# Altium project Switch.PrjPcb
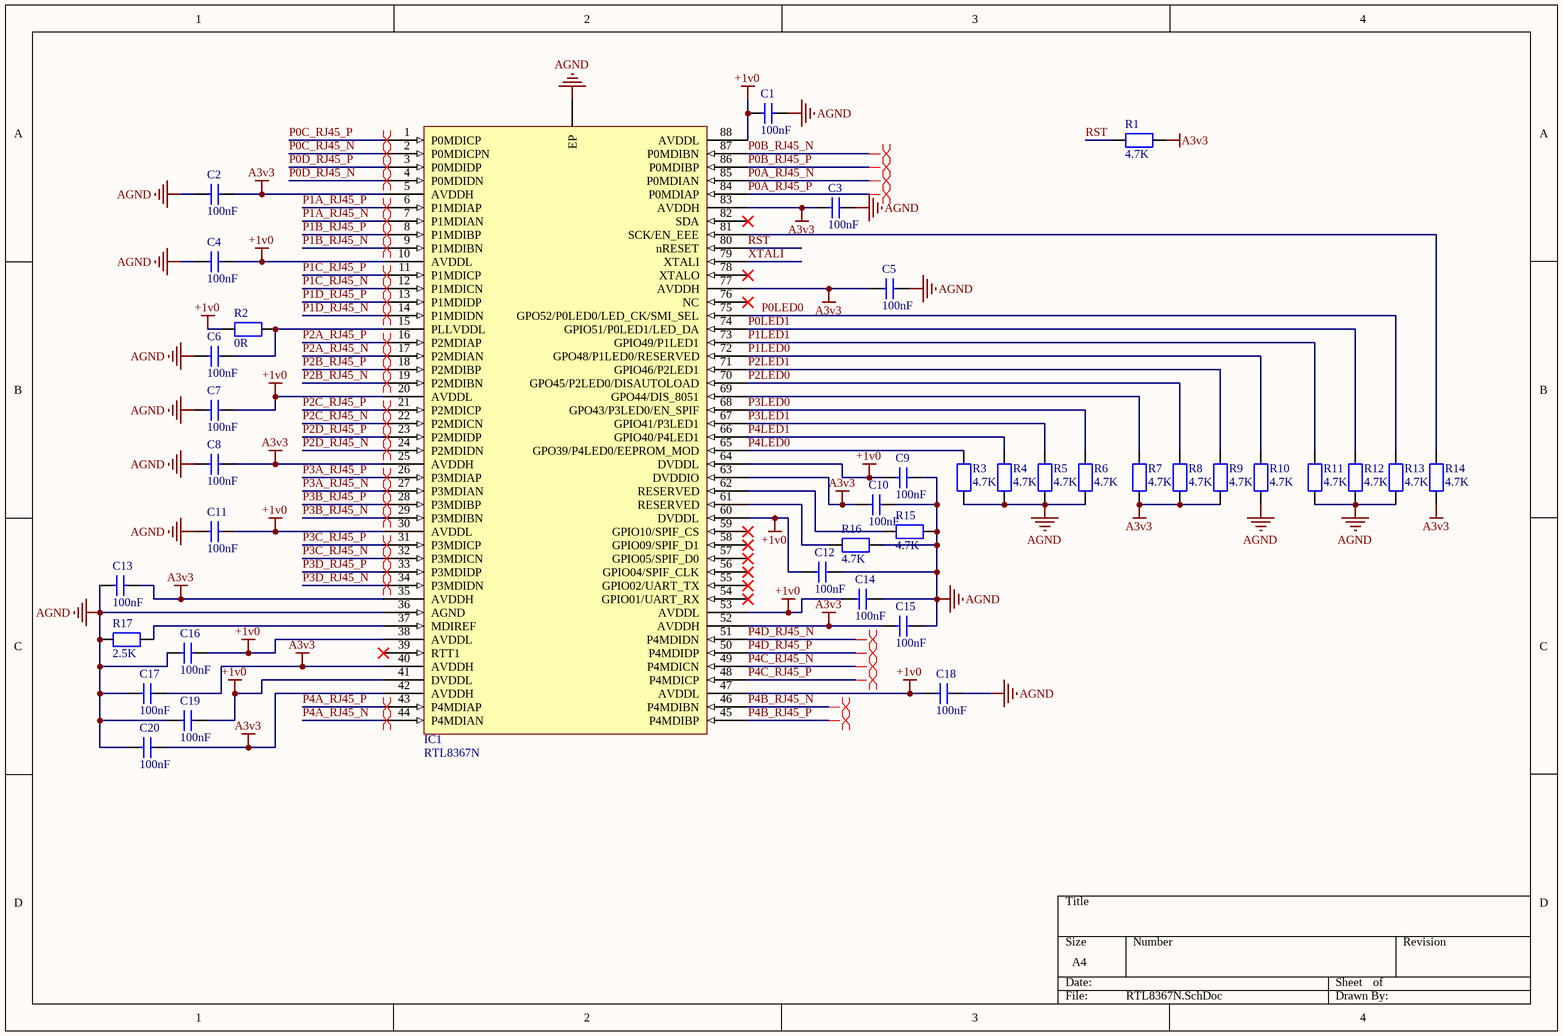
[diagram p0: RTL8367N.SchDoc]
4 sheets, 94 parts. Net scope: global (net labels, ports and power ports of the same name join across sheets).
Board file: Switch.PcbDoc
Sheets:
  RTL8367N.SchDoc
  RJ45.SchDoc
  Power.SchDoc
  Crystal.SchDoc

## Sheet RTL8367N.SchDoc
size A4; SheetNumber: 1; SheetTotal: 4

### Parts
C1  100nF  [C-0603]
C2  100nF  [C-0603]
C3  100nF  [C-0603]
C4  100nF  [C-0603]
C5  100nF  [C-0603]
C6  100nF  [C-0603]
C7  100nF  [C-0603]
C8  100nF  [C-0603]
C9  100nF  [C-0603]
C10  100nF  [C-0603]
C11  100nF  [C-0603]
C12  100nF  [C-0603]
C13  100nF  [C-0603]
C14  100nF  [C-0603]
C15  100nF  [C-0603]
C16  100nF  [C-0603]
C17  100nF  [C-0603]
C18  100nF  [C-0603]
C19  100nF  [C-0603]
C20  100nF  [C-0603]
IC1  RTL8367N  [QFN40P1000X1000X90_HS-89M]
R1  4.7K  [RESMELF3515L]
R2  0R  [RESMELF3515L]
R3  4.7K  [RESMELF3515L]
R4  4.7K  [RESMELF3515L]
R5  4.7K  [RESMELF3515L]
R6  4.7K  [RESMELF3515L]
R7  4.7K  [RESMELF3515L]
R8  4.7K  [RESMELF3515L]
R9  4.7K  [RESMELF3515L]
R10  4.7K  [RESMELF3515L]
R11  4.7K  [RESMELF3515L]
R12  4.7K  [RESMELF3515L]
R13  4.7K  [RESMELF3515L]
R14  4.7K  [RESMELF3515L]
R15  4.7K  [RESMELF3515L]
R16  4.7K  [RESMELF3515L]
R17  2.5K  [RESMELF3515L]

### Nets
+1v0: C1.1 C4.2 C7.2 C9.1 C11.2 C12.1 C14.1 C16.2 C18.1 C19.2 IC1.10(AVDDL) IC1.20(AVDDL) IC1.30(AVDDL) IC1.38(AVDDL) IC1.41(DVDDL) IC1.47(AVDDL) IC1.53(AVDDL) IC1.60(DVDDL) IC1.64(DVDDL) IC1.88(AVDDL) R2.1
A3v3: C2.2 C3.1 C5.1 C8.2 C10.1 C13.2 C15.1 C17.2 C20.2 IC1.5(AVDDH) IC1.25(AVDDH) IC1.35(AVDDH) IC1.40(AVDDH) IC1.42(AVDDH) IC1.52(AVDDH) IC1.63(DVDDIO) IC1.77(AVDDH) IC1.83(AVDDH) R1.2 R7.1 R8.1 R9.1 R14.1
AGND: C1.2 C2.1 C3.2 C4.1 C5.2 C6.1 C7.1 C8.1 C9.2 C10.2 C11.1 C12.2 C13.1 C14.2 C15.2 C16.1 C17.1 C18.2 C19.1 C20.1 IC1.36(AGND) IC1.89(EP) R3.1 R4.1 R5.1 R6.1 R10.1 R11.1 R12.1 R13.1 R15.2 R16.2 R17.1
P0A_RJ45_N: IC1.85(P0MDIAN)
P0A_RJ45_P: IC1.84(P0MDIAP)
P0B_RJ45_N: IC1.87(P0MDIBN)
P0B_RJ45_P: IC1.86(P0MDIBP)
P0C_RJ45_N: IC1.2(P0MDICPN)
P0C_RJ45_P: IC1.1(P0MDICP)
P0D_RJ45_N: IC1.4(P0MDIDN)
P0D_RJ45_P: IC1.3(P0MDIDP)
P0LED0: IC1.75(GPO52/P0LED0/LED_CK/SMI_SEL) R13.2
P0LED1: IC1.74(GPIO51/P0LED1/LED_DA) R12.2
P1A_RJ45_N: IC1.7(P1MDIAN)
P1A_RJ45_P: IC1.6(P1MDIAP)
P1B_RJ45_N: IC1.9(P1MDIBN)
P1B_RJ45_P: IC1.8(P1MDIBP)
P1C_RJ45_N: IC1.12(P1MDICN)
P1C_RJ45_P: IC1.11(P1MDICP)
P1D_RJ45_N: IC1.14(P1MDIDN)
P1D_RJ45_P: IC1.13(P1MDIDP)
P1LED0: IC1.72(GPO48/P1LED0/RESERVED) R10.2
P1LED1: IC1.73(GPIO49/P1LED1) R11.2
P2A_RJ45_N: IC1.17(P2MDIAN)
P2A_RJ45_P: IC1.16(P2MDIAP)
P2B_RJ45_N: IC1.19(P2MDIBN)
P2B_RJ45_P: IC1.18(P2MDIBP)
P2C_RJ45_N: IC1.22(P2MDICN)
P2C_RJ45_P: IC1.21(P2MDICP)
P2D_RJ45_N: IC1.24(P2MDIDN)
P2D_RJ45_P: IC1.23(P2MDIDP)
P2LED0: IC1.70(GPO45/P2LED0/DISAUTOLOAD) R8.2
P2LED1: IC1.71(GPIO46/P2LED1) R9.2
P3A_RJ45_N: IC1.27(P3MDIAN)
P3A_RJ45_P: IC1.26(P3MDIAP)
P3B_RJ45_N: IC1.29(P3MDIBN)
P3B_RJ45_P: IC1.28(P3MDIBP)
P3C_RJ45_N: IC1.32(P3MDICN)
P3C_RJ45_P: IC1.31(P3MDICP)
P3D_RJ45_N: IC1.34(P3MDIDN)
P3D_RJ45_P: IC1.33(P3MDIDP)
P3LED0: IC1.68(GPO43/P3LED0/EN_SPIF) R6.2
P3LED1: IC1.67(GPIO41/P3LED1) R5.2
P4A_RJ45_N: IC1.44(P4MDIAN)
P4A_RJ45_P: IC1.43(P4MDIAP)
P4B_RJ45_N: IC1.46(P4MDIBN)
P4B_RJ45_P: IC1.45(P4MDIBP)
P4C_RJ45_N: IC1.49(P4MDICN)
P4C_RJ45_P: IC1.48(P4MDICP)
P4D_RJ45_N: IC1.51(P4MDIDN)
P4D_RJ45_P: IC1.50(P4MDIDP)
P4LED0: IC1.65(GPO39/P4LED0/EEPROM_MOD) R3.2
P4LED1: IC1.66(GPIO40/P4LED1) R4.2
RST: IC1.80(nRESET) R1.1
XTALI: IC1.79(XTALI)
NetC6_2: C6.2 IC1.15(PLLVDDL) R2.2
NetIC1_37: IC1.37(MDIREF) R17.2
NetIC1_61: IC1.61(RESERVED) R16.1
NetIC1_62: IC1.62(RESERVED) R15.1
NetIC1_69: IC1.69(GPO44/DIS_8051) R7.2
NetIC1_81: IC1.81(SCK/EN_EEE) R14.2

Not connected (* = marked no-connect by the designer): IC1 39(RTT1)* 54(GPIO01/UART_RX)* 55(GPIO02/UART_TX)* 56(GPIO04/SPIF_CLK)* 57(GPIO05/SPIF_D0)* 58(GPIO09/SPIF_D1)* 59(GPIO10/SPIF_CS)* 76(NC)* 78(XTALO)* 82(SDA)*

### Layout directives
differential pair: P0A_RJ45_N, P0A_RJ45_P, P0B_RJ45_N, P0B_RJ45_P, P0C_RJ45_N, P0C_RJ45_P, P0D_RJ45_N, P0D_RJ45_P, P1A_RJ45_N, P1A_RJ45_P, P1B_RJ45_N, P1B_RJ45_P, P1C_RJ45_N, P1C_RJ45_P, P1D_RJ45_N, P1D_RJ45_P, P2A_RJ45_N, P2A_RJ45_P, P2B_RJ45_N, P2B_RJ45_P, P2C_RJ45_N, P2C_RJ45_P, P2D_RJ45_N, P2D_RJ45_P, P3A_RJ45_N, P3A_RJ45_P, P3B_RJ45_N, P3B_RJ45_P, P3C_RJ45_N, P3C_RJ45_P, P3D_RJ45_N, P3D_RJ45_P, P4A_RJ45_N, P4A_RJ45_P, P4B_RJ45_N, P4B_RJ45_P, P4C_RJ45_N, P4C_RJ45_P, P4D_RJ45_N, P4D_RJ45_P

### Library data of the parts
C1-C20 = C-0603
IC1 = RTL8367N: RTL8367N-VB-CG
R1-R17 = CSR-0204

## Sheet RJ45.SchDoc
size A4; SheetNumber: 2; SheetTotal: 4
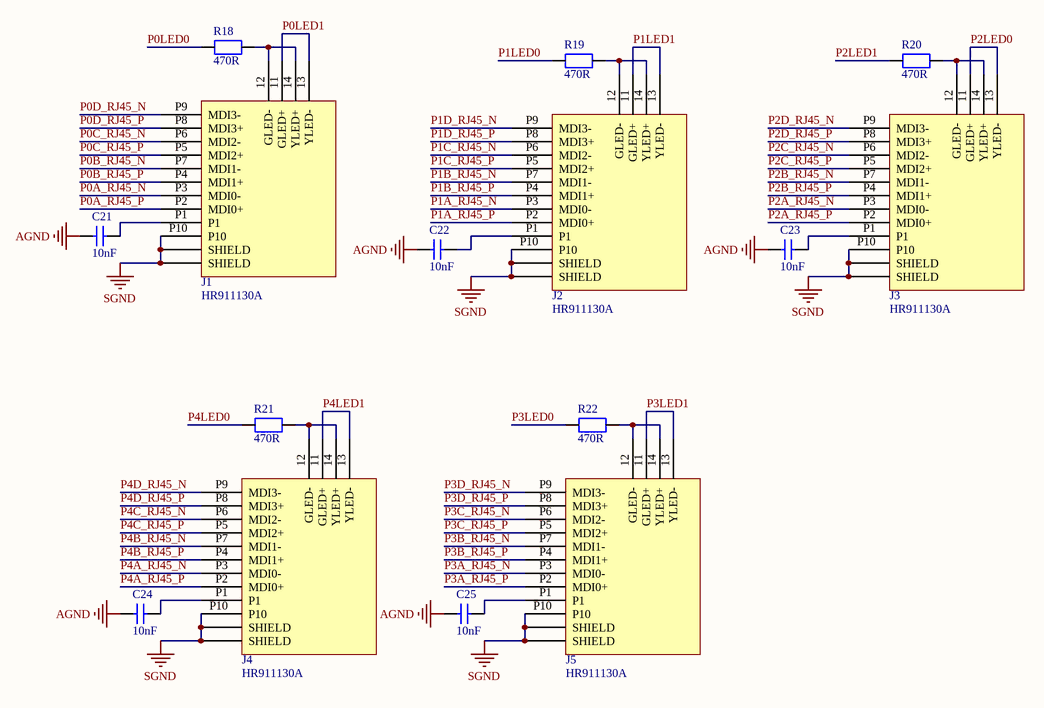
[diagram p1: RJ45.SchDoc]

### Parts
C21  10nF  [C-0603]
C22  10nF  [C-0603]
C23  10nF  [C-0603]
C24  10nF  [C-0603]
C25  10nF  [C-0603]
J1  HR911130A  [RJ45]
J2  HR911130A  [RJ45]
J3  HR911130A  [RJ45]
J4  HR911130A  [RJ45]
J5  HR911130A  [RJ45]
R18  470R  [RESMELF3515L]
R19  470R  [RESMELF3515L]
R20  470R  [RESMELF3515L]
R21  470R  [RESMELF3515L]
R22  470R  [RESMELF3515L]

### Nets
AGND: C21.2 C22.2 C23.2 C24.1 C25.2
SGND: J1.P10 J1.SHIELD0(SHIELD) J1.SHIELD1(SHIELD) J2.P10 J2.SHIELD0(SHIELD) J2.SHIELD1(SHIELD) J3.P10 J3.SHIELD0(SHIELD) J3.SHIELD1(SHIELD) J4.P10 J4.SHIELD0(SHIELD) J4.SHIELD1(SHIELD) J5.P10 J5.SHIELD0(SHIELD) J5.SHIELD1(SHIELD)
P0A_RJ45_N: J1.P3(MDI0-)
P0A_RJ45_P: J1.P2(MDI0+)
P0B_RJ45_N: J1.P7(MDI1-)
P0B_RJ45_P: J1.P4(MDI1+)
P0C_RJ45_N: J1.P6(MDI2-)
P0C_RJ45_P: J1.P5(MDI2+)
P0D_RJ45_N: J1.P9(MDI3-)
P0D_RJ45_P: J1.P8(MDI3+)
P0LED0: R18.1
P0LED1: J1.11(GLED+) J1.13(YLED-)
P1A_RJ45_N: J2.P3(MDI0-)
P1A_RJ45_P: J2.P2(MDI0+)
P1B_RJ45_N: J2.P7(MDI1-)
P1B_RJ45_P: J2.P4(MDI1+)
P1C_RJ45_N: J2.P6(MDI2-)
P1C_RJ45_P: J2.P5(MDI2+)
P1D_RJ45_N: J2.P9(MDI3-)
P1D_RJ45_P: J2.P8(MDI3+)
P1LED0: R19.1
P1LED1: J2.11(GLED+) J2.13(YLED-)
P2A_RJ45_N: J3.P3(MDI0-)
P2A_RJ45_P: J3.P2(MDI0+)
P2B_RJ45_N: J3.P7(MDI1-)
P2B_RJ45_P: J3.P4(MDI1+)
P2C_RJ45_N: J3.P6(MDI2-)
P2C_RJ45_P: J3.P5(MDI2+)
P2D_RJ45_N: J3.P9(MDI3-)
P2D_RJ45_P: J3.P8(MDI3+)
P2LED0: J3.11(GLED+) J3.13(YLED-)
P2LED1: R20.1
P3A_RJ45_N: J5.P3(MDI0-)
P3A_RJ45_P: J5.P2(MDI0+)
P3B_RJ45_N: J5.P7(MDI1-)
P3B_RJ45_P: J5.P4(MDI1+)
P3C_RJ45_N: J5.P6(MDI2-)
P3C_RJ45_P: J5.P5(MDI2+)
P3D_RJ45_N: J5.P9(MDI3-)
P3D_RJ45_P: J5.P8(MDI3+)
P3LED0: R22.1
P3LED1: J5.11(GLED+) J5.13(YLED-)
P4A_RJ45_N: J4.P3(MDI0-)
P4A_RJ45_P: J4.P2(MDI0+)
P4B_RJ45_N: J4.P7(MDI1-)
P4B_RJ45_P: J4.P4(MDI1+)
P4C_RJ45_N: J4.P6(MDI2-)
P4C_RJ45_P: J4.P5(MDI2+)
P4D_RJ45_N: J4.P9(MDI3-)
P4D_RJ45_P: J4.P8(MDI3+)
P4LED0: R21.1
P4LED1: J4.11(GLED+) J4.13(YLED-)
NetC21_1: C21.1 J1.P1
NetC22_1: C22.1 J2.P1
NetC23_1: C23.1 J3.P1
NetC24_2: C24.2 J4.P1
NetC25_1: C25.1 J5.P1
NetJ1_12: J1.12(GLED-) J1.14(YLED+) R18.2
NetJ2_12: J2.12(GLED-) J2.14(YLED+) R19.2
NetJ3_12: J3.12(GLED-) J3.14(YLED+) R20.2
NetJ4_12: J4.12(GLED-) J4.14(YLED+) R21.2
NetJ5_12: J5.12(GLED-) J5.14(YLED+) R22.2

### Library data of the parts
C21-C25 = C-0603
R18-R22 = CSR-0204

## Sheet Power.SchDoc
size A4; SheetNumber: 3; SheetTotal: 4
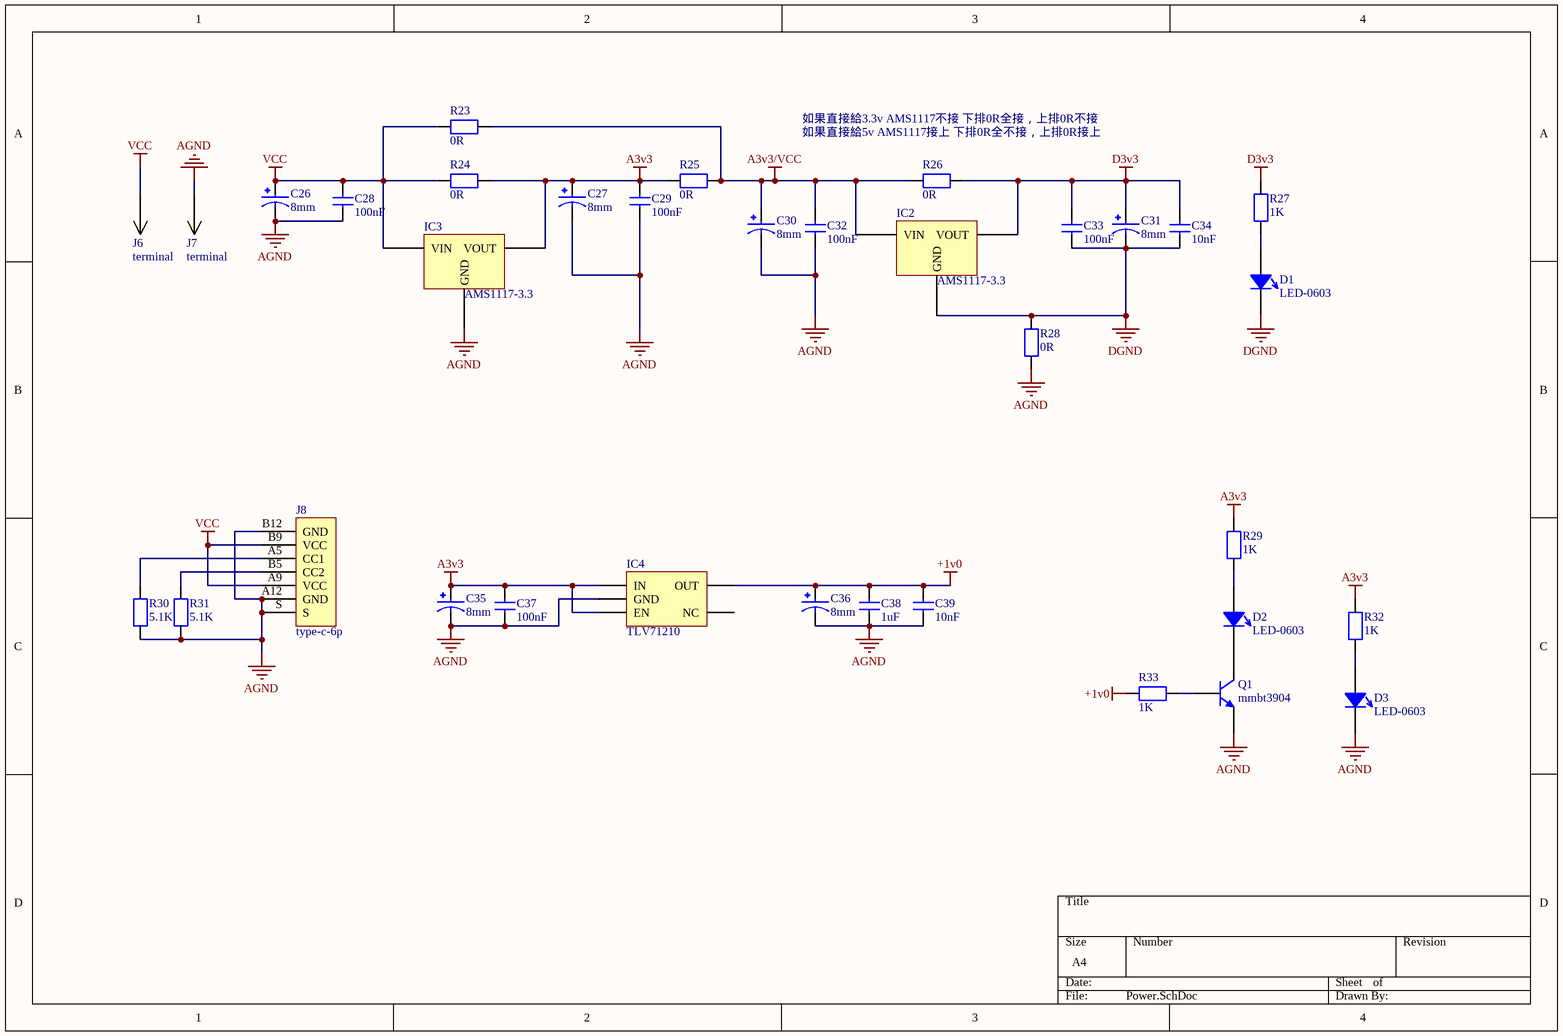
[diagram p2: Power.SchDoc]

### Parts
C26  8mm  [CAP_dual]
C27  8mm  [CAP_dual]
C28  100nF  [C-0603]
C29  100nF  [C-0603]
C30  8mm  [CAP_dual]
C31  8mm  [CAP_dual]
C32  100nF  [C-0603]
C33  100nF  [C-0603]
C34  10nF  [C-0603]
C35  8mm  [CAP_dual]
C36  8mm  [CAP_dual]
C37  100nF  [C-0603]
C38  1uF  [C-0603]
C39  10nF  [C-0603]
D1  LED-0603  [LED-0603]
D2  LED-0603  [LED-0603]
D3  LED-0603  [LED-0603]
IC2  AMS1117-3.3  [SOT-223]
IC3  AMS1117-3.3  [SOT-223]
IC4  TLV71210  [SOT95P245X110-5L]
J6  terminal  [Terminal-6.3mm]
J7  terminal  [Terminal-6.3mm]
J8  type-c-6p  [type-c_6p]
Q1  mmbt3904  [SOT23-L]
R23  0R  [RESMELF3515L]
R24  0R  [RESMELF3515L]
R25  0R  [RESMELF3515L]
R26  0R  [RESMELF3515L]
R27  1K  [RESMELF3515L]
R28  0R  [RESMELF3515L]
R29  1K  [RESMELF3515L]
R30  5.1K  [R-0603]
R31  5.1K  [R-0603]
R32  1K  [RESMELF3515L]
R33  1K  [RESMELF3515L]

### Nets
+1v0: C36.1 C38.2 C39.2 IC4.5(OUT) R33.2
A3v3: C27.1 C29.2 C35.1 C37.2 IC3.2(VOUT) IC4.1(IN) IC4.3(EN) R24.2 R25.1 R29.2 R32.2
A3v3/VCC: C30.1 C32.2 IC2.3(VIN) R23.2 R25.2 R26.1
AGND: C26.2 C27.2 C28.1 C29.1 C30.2 C32.1 C35.2 C36.2 C37.1 C38.1 C39.1 D3.2 IC3.1(GND) IC4.2(GND) J7.1 J8.A12(GND) J8.B12(GND) J8.S Q1.2(E) R28.1 R30.2 R31.2
D3v3: C31.1 C33.2 C34.2 IC2.2(VOUT) R26.2 R27.2
DGND: C31.2 C33.1 C34.1 D1.2 IC2.1(GND) R28.2
VCC: C26.1 C28.2 IC3.3(VIN) J6.1 J8.A9(VCC) J8.B9(VCC) R23.1 R24.1
NetD1_1: D1.1 R27.1
NetD2_1: D2.1 R29.1
NetD2_2: D2.2 Q1.3(C)
NetD3_1: D3.1 R32.1
NetJ8_A5: J8.A5(CC1) R30.1
NetJ8_B5: J8.B5(CC2) R31.1
NetQ1_1: Q1.1(B) R33.1

Not connected (* = marked no-connect by the designer): IC4 4(NC)

### Notes on the sheet
- 如果直接給3.3v AMS1117不接 下排0R全接，上排0R不接
- (near R26) 如果直接給5v AMS1117接上 下排0R全不接，上排0R接上

### Library data of the parts
C26 C27 C30 C31 C35 C36 = dip-cap: 8mm cap
C28 C29 C32-C34 C37-C39 = C-0603
IC4 = TLV71210: 1V LDO TLV71210DBVR / AP7335-10WG-7
J6 J7 = 6.3mm-terminal
J8 = type-c-6p: C668623
Q1 = NPN
R23 R25 R26 R28 = CSR-0204: Bypass
R24 = CSR-0204: Bypsaa
R27 R29 R32 R33 = CSR-0204
R30 R31 = R-0603

## Sheet Crystal.SchDoc
size A4; SheetNumber: 4; SheetTotal: 4
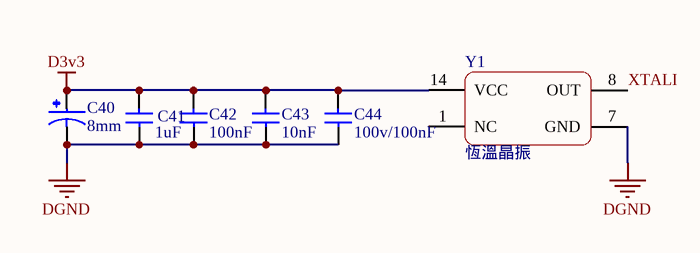
[diagram p3: Crystal.SchDoc]

### Parts
C40  8mm  [CAP_dual]
C41  1uF  [C-0603]
C42  100nF  [C-0603]
C43  10nF  [C-0603]
C44  100v/100nF  [100v0.1u]
Y1  恆溫晶振  [恆溫晶振]

### Nets
D3v3: C40.1 C41.2 C42.2 C43.2 C44.2 Y1.14(VCC)
DGND: C40.2 C41.1 C42.1 C43.1 C44.1 Y1.7(GND)
XTALI: Y1.8(OUT)

Not connected (* = marked no-connect by the designer): Y1 1(NC)

### Library data of the parts
C40 = dip-cap: 8mm cap
C41-C43 = C-0603
C44 = plastic cap: plastic capacitor

## Nets that join several sheets
+1v0: RTL8367N (21 pins), Power (5 pins)
A3v3: RTL8367N (23 pins), Power (11 pins)
AGND: RTL8367N (33 pins), RJ45 (5 pins), Power (22 pins)
D3v3: Power (6 pins), Crystal (6 pins)
DGND: Power (6 pins), Crystal (6 pins)
P0A_RJ45_N: RTL8367N (IC1.85), RJ45 (J1.P3)
P0A_RJ45_P: RTL8367N (IC1.84), RJ45 (J1.P2)
P0B_RJ45_N: RTL8367N (IC1.87), RJ45 (J1.P7)
P0B_RJ45_P: RTL8367N (IC1.86), RJ45 (J1.P4)
P0C_RJ45_N: RTL8367N (IC1.2), RJ45 (J1.P6)
P0C_RJ45_P: RTL8367N (IC1.1), RJ45 (J1.P5)
P0D_RJ45_N: RTL8367N (IC1.4), RJ45 (J1.P9)
P0D_RJ45_P: RTL8367N (IC1.3), RJ45 (J1.P8)
P0LED0: RTL8367N (IC1.75 R13.2), RJ45 (R18.1)
P0LED1: RTL8367N (IC1.74 R12.2), RJ45 (J1.11 J1.13)
P1A_RJ45_N: RTL8367N (IC1.7), RJ45 (J2.P3)
P1A_RJ45_P: RTL8367N (IC1.6), RJ45 (J2.P2)
P1B_RJ45_N: RTL8367N (IC1.9), RJ45 (J2.P7)
P1B_RJ45_P: RTL8367N (IC1.8), RJ45 (J2.P4)
P1C_RJ45_N: RTL8367N (IC1.12), RJ45 (J2.P6)
P1C_RJ45_P: RTL8367N (IC1.11), RJ45 (J2.P5)
P1D_RJ45_N: RTL8367N (IC1.14), RJ45 (J2.P9)
P1D_RJ45_P: RTL8367N (IC1.13), RJ45 (J2.P8)
P1LED0: RTL8367N (IC1.72 R10.2), RJ45 (R19.1)
P1LED1: RTL8367N (IC1.73 R11.2), RJ45 (J2.11 J2.13)
P2A_RJ45_N: RTL8367N (IC1.17), RJ45 (J3.P3)
P2A_RJ45_P: RTL8367N (IC1.16), RJ45 (J3.P2)
P2B_RJ45_N: RTL8367N (IC1.19), RJ45 (J3.P7)
P2B_RJ45_P: RTL8367N (IC1.18), RJ45 (J3.P4)
P2C_RJ45_N: RTL8367N (IC1.22), RJ45 (J3.P6)
P2C_RJ45_P: RTL8367N (IC1.21), RJ45 (J3.P5)
P2D_RJ45_N: RTL8367N (IC1.24), RJ45 (J3.P9)
P2D_RJ45_P: RTL8367N (IC1.23), RJ45 (J3.P8)
P2LED0: RTL8367N (IC1.70 R8.2), RJ45 (J3.11 J3.13)
P2LED1: RTL8367N (IC1.71 R9.2), RJ45 (R20.1)
P3A_RJ45_N: RTL8367N (IC1.27), RJ45 (J5.P3)
P3A_RJ45_P: RTL8367N (IC1.26), RJ45 (J5.P2)
P3B_RJ45_N: RTL8367N (IC1.29), RJ45 (J5.P7)
P3B_RJ45_P: RTL8367N (IC1.28), RJ45 (J5.P4)
P3C_RJ45_N: RTL8367N (IC1.32), RJ45 (J5.P6)
P3C_RJ45_P: RTL8367N (IC1.31), RJ45 (J5.P5)
P3D_RJ45_N: RTL8367N (IC1.34), RJ45 (J5.P9)
P3D_RJ45_P: RTL8367N (IC1.33), RJ45 (J5.P8)
P3LED0: RTL8367N (IC1.68 R6.2), RJ45 (R22.1)
P3LED1: RTL8367N (IC1.67 R5.2), RJ45 (J5.11 J5.13)
P4A_RJ45_N: RTL8367N (IC1.44), RJ45 (J4.P3)
P4A_RJ45_P: RTL8367N (IC1.43), RJ45 (J4.P2)
P4B_RJ45_N: RTL8367N (IC1.46), RJ45 (J4.P7)
P4B_RJ45_P: RTL8367N (IC1.45), RJ45 (J4.P4)
P4C_RJ45_N: RTL8367N (IC1.49), RJ45 (J4.P6)
P4C_RJ45_P: RTL8367N (IC1.48), RJ45 (J4.P5)
P4D_RJ45_N: RTL8367N (IC1.51), RJ45 (J4.P9)
P4D_RJ45_P: RTL8367N (IC1.50), RJ45 (J4.P8)
P4LED0: RTL8367N (IC1.65 R3.2), RJ45 (R21.1)
P4LED1: RTL8367N (IC1.66 R4.2), RJ45 (J4.11 J4.13)
XTALI: RTL8367N (IC1.79), Crystal (Y1.8)